# EAGLE schematic Smart_LIghts (EAGLE 9.5.1)
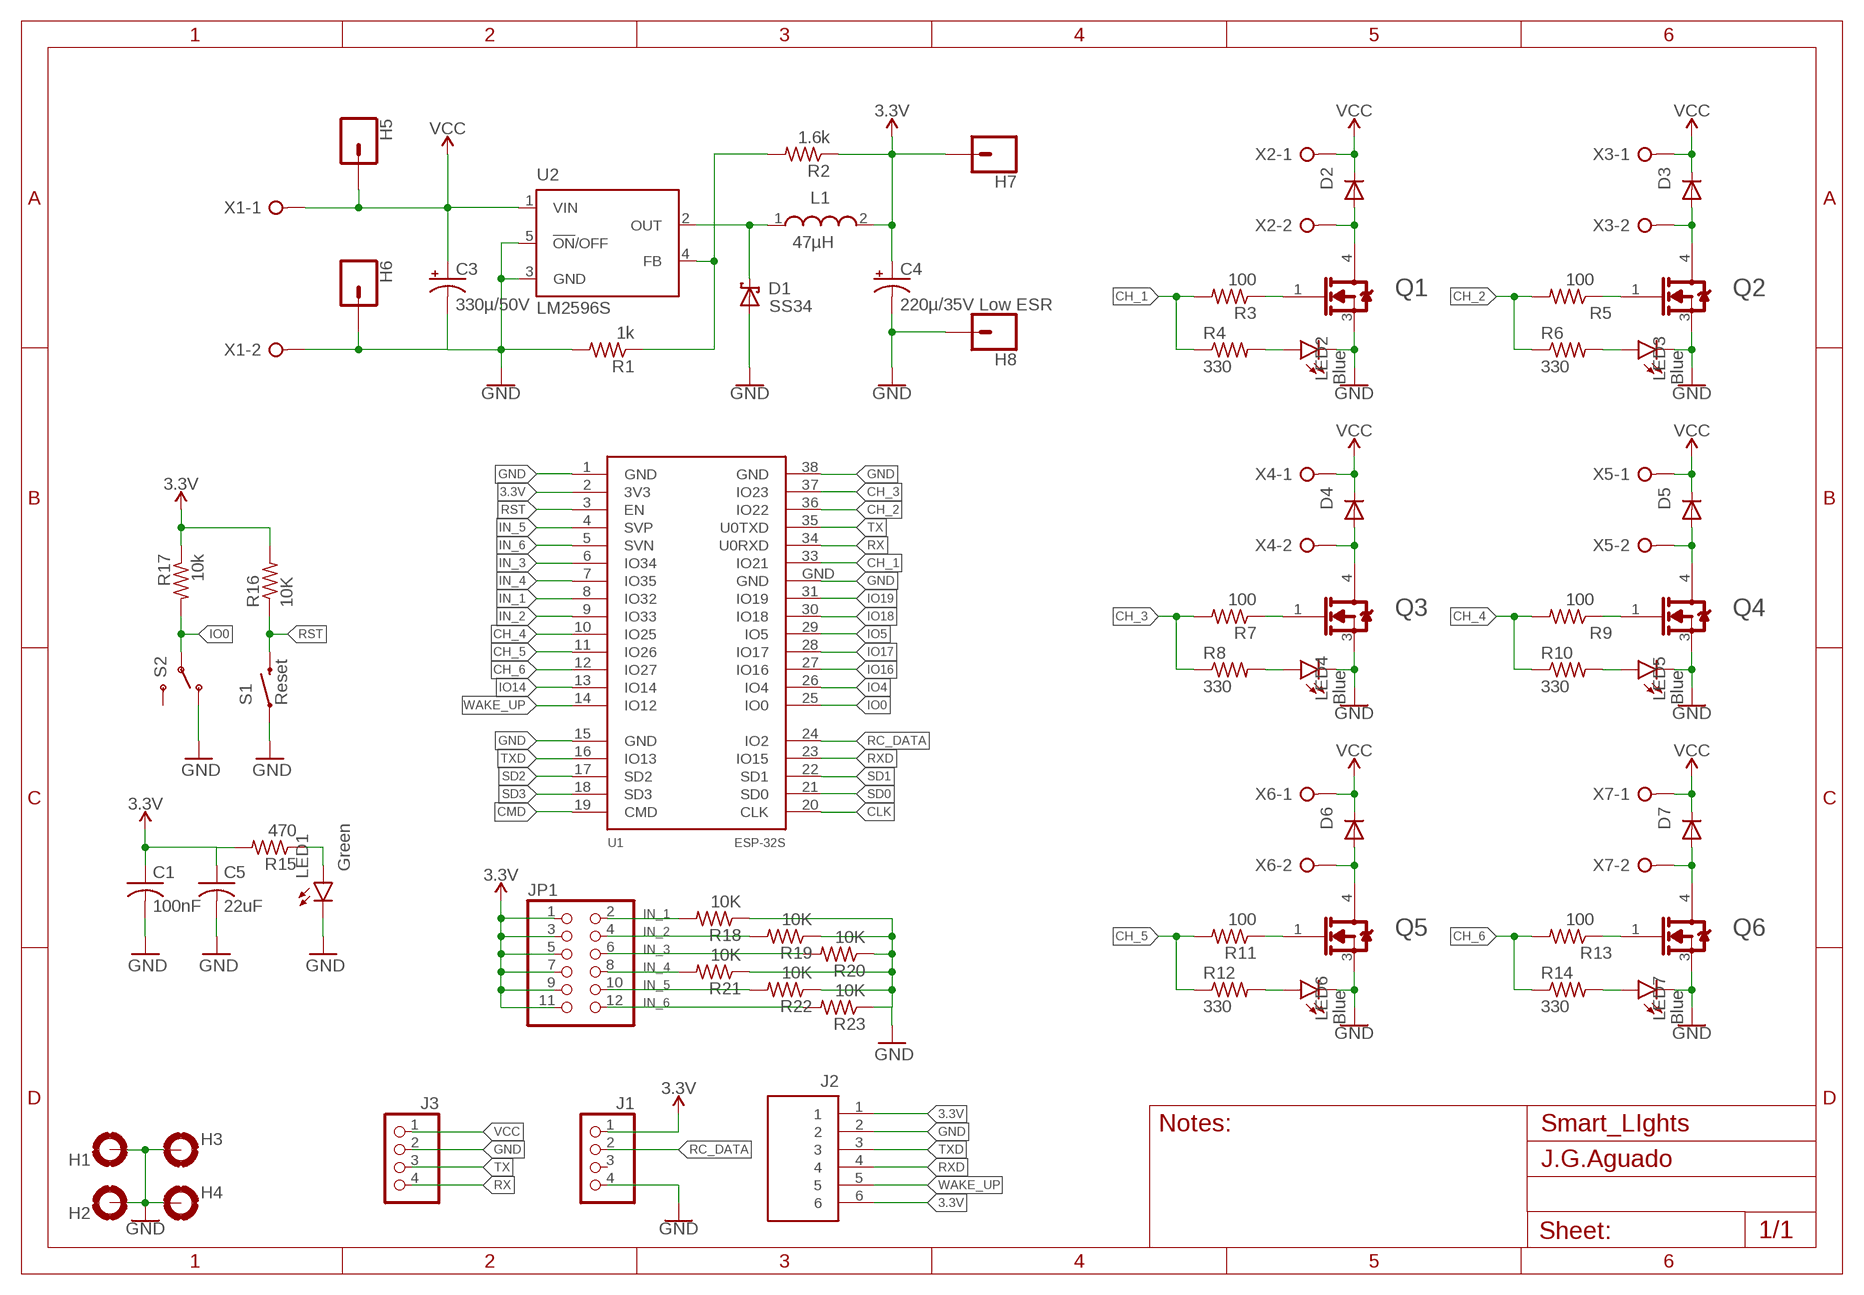
[diagram p0: schematic, sheet 1]

## Parts
C1  100nF  C-USC0603  [C0603]
C3  330µ/50V  CPOL-USF  [PANASONIC_F]
C4  220µ/35V Low ESR  CPOL-USF  [PANASONIC_F]
C5  22uF  C-USC0603  [C0603]
D1  SS34  SCHOTTKY-DIODESMD  [SMB]
D2  DIODE-SOD123  [SOD123]
D3  DIODE-SOD123  [SOD123]
D4  DIODE-SOD123  [SOD123]
D5  DIODE-SOD123  [SOD123]
D6  DIODE-SOD123  [SOD123]
D7  DIODE-SOD123  [SOD123]
H1  MOUNT-PAD-ROUND3.0  [3,0-PAD]
H2  MOUNT-PAD-ROUND3.0  [3,0-PAD]
H3  MOUNT-PAD-ROUND3.0  [3,0-PAD]
H4  MOUNT-PAD-ROUND3.0  [3,0-PAD]
H5  CONN_01PTH_2MM  [1X01_2MM]
H6  CONN_01PTH_2MM  [1X01_2MM]
H7  CONN_01PTH_2MM  [1X01_2MM]
H8  CONN_01PTH_2MM  [1X01_2MM]
J1  PINHD-1X4  [1X04]
J2  JST_6_PIN_VERTICAL  [JST-6-SMD-VERT-1.0MM]
J3  PINHD-1X4  [1X04]
JP1  PINHD-2X6  [2X06]
L1  47µH  WE-PD_1260/1245/1280/1210  [WE-PD_1260/1245/1280/1210]
LED1  Green  LEDSML0603  [SML0603]
LED2  Blue  LEDSML0603  [SML0603]
LED3  Blue  LEDSML0603  [SML0603]
LED4  Blue  LEDSML0603  [SML0603]
LED5  Blue  LEDSML0603  [SML0603]
LED6  Blue  LEDSML0603  [SML0603]
LED7  Blue  LEDSML0603  [SML0603]
Q1  IRLR2905TRPBF  INFINEON_TECHNOLOGIES_IRLR2905TRPBFINFINEON_TECHNOLOGIES_IRLR2905TRPBF_0_0  [INFINEON_TECHNOLOGIES_IRLR2905TRPBF_0]
Q2  IRLR2905TRPBF  INFINEON_TECHNOLOGIES_IRLR2905TRPBFINFINEON_TECHNOLOGIES_IRLR2905TRPBF_0_0  [INFINEON_TECHNOLOGIES_IRLR2905TRPBF_0]
Q3  IRLR2905TRPBF  INFINEON_TECHNOLOGIES_IRLR2905TRPBFINFINEON_TECHNOLOGIES_IRLR2905TRPBF_0_0  [INFINEON_TECHNOLOGIES_IRLR2905TRPBF_0]
Q4  IRLR2905TRPBF  INFINEON_TECHNOLOGIES_IRLR2905TRPBFINFINEON_TECHNOLOGIES_IRLR2905TRPBF_0_0  [INFINEON_TECHNOLOGIES_IRLR2905TRPBF_0]
Q5  IRLR2905TRPBF  INFINEON_TECHNOLOGIES_IRLR2905TRPBFINFINEON_TECHNOLOGIES_IRLR2905TRPBF_0_0  [INFINEON_TECHNOLOGIES_IRLR2905TRPBF_0]
Q6  IRLR2905TRPBF  INFINEON_TECHNOLOGIES_IRLR2905TRPBFINFINEON_TECHNOLOGIES_IRLR2905TRPBF_0_0  [INFINEON_TECHNOLOGIES_IRLR2905TRPBF_0]
R1  1k  R-US_R0603  [R0603]
R2  1.6k  R-US_R0603  [R0603]
R3  100  R-US_R0603  [R0603]
R4  330  R-US_R0603  [R0603]
R5  100  R-US_R0603  [R0603]
R6  330  R-US_R0603  [R0603]
R7  100  R-US_R0603  [R0603]
R8  330  R-US_R0603  [R0603]
R9  100  R-US_R0603  [R0603]
R10  330  R-US_R0603  [R0603]
R11  100  R-US_R0603  [R0603]
R12  330  R-US_R0603  [R0603]
R13  100  R-US_R0603  [R0603]
R14  330  R-US_R0603  [R0603]
R15  470  R-US_R0603  [R0603]
R16  10K  R-US_R0603  [R0603]
R17  10k  R-US_R0603  [R0603]
R18  10K  R-US_R0603  [R0603]
R19  10K  R-US_R0603  [R0603]
R20  10K  R-US_R0603  [R0603]
R21  10K  R-US_R0603  [R0603]
R22  10K  R-US_R0603  [R0603]
R23  10K  R-US_R0603  [R0603]
S1  Reset  SWITCH-MOMENTARY-2SMD-4  [TACTILE_SWITCH_TALL]
S2  SWITCH_SPDT  [KPS-1290]
U1  ESP-32S  [ESP-32S]
U2  LM2596S  [TO263-5]
X1  W237-02P  [W237-132]
X2  W237-02P  [W237-132]
X3  W237-02P  [W237-132]
X4  W237-02P  [W237-132]
X5  W237-02P  [W237-132]
X6  W237-02P  [W237-132]
X7  W237-02P  [W237-132]

## Nets
3.3V: C1.1 C4.+ C5.1 H7.1 J1.1 J2.1 J2.6 JP1.1 JP1.3 JP1.5 JP1.7 JP1.9 JP1.11 L1.2 R2.1 R15.2 R16.2 R17.1 U1.2(3V3)
CH_1: R3.2 R4.1 U1.33(IO21)
CH_2: R5.2 R6.1 U1.36(IO22)
CH_3: R7.2 R8.1 U1.37(IO23)
CH_4: R9.2 R10.1 U1.10(IO25)
CH_5: R11.2 R12.1 U1.11(IO26)
CH_6: R13.2 R14.1 U1.12(IO27)
CLK: U1.20(CLK)
CMD: U1.19(CMD)
GND: C1.2 C3.- C4.- C5.2 D1.A H1.B3,0(MOUNT) H2.B3,0(MOUNT) H3.B3,0(MOUNT) H4.B3,0(MOUNT) H6.1 H8.1 J1.4 J2.2 J3.2 LED1.C LED2.C LED3.C LED4.C LED5.C LED6.C LED7.C Q1.3(SOURCE) Q2.3(SOURCE) Q3.3(SOURCE) Q4.3(SOURCE) Q5.3(SOURCE) Q6.3(SOURCE) R1.2 R18.1 R19.1 R20.1 R21.1 R22.1 R23.1 S1.A2 S2.O U1.1(GND) U1.15(GND) U1.38(GND) U1.GND U2.3(GND) U2.5(!ON!/OFF) X1.2
IN_1: JP1.2 R18.2 U1.8(IO32)
IN_2: JP1.4 R19.2 U1.9(IO33)
IN_3: JP1.6 R20.2 U1.6(IO34)
IN_4: JP1.8 R21.2 U1.7(IO35)
IN_5: JP1.10 R22.2 U1.4(SVP)
IN_6: JP1.12 R23.2 U1.5(SVN)
IO0: R17.2 S2.P U1.25(IO0)
IO4: U1.26(IO4)
IO5: U1.29(IO5)
IO14: U1.13(IO14)
IO16: U1.27(IO16)
IO17: U1.28(IO17)
IO18: U1.30(IO18)
IO19: U1.31(IO19)
N$1: Q2.1(GATE) R5.1
N$2: D1.C L1.1 U2.2(OUT)
N$3: R1.1 R2.2 U2.4(FB)
N$4: D2.A Q1.4(DRAIN) X2.2
N$5: Q1.1(GATE) R3.1
N$6: D3.A Q2.4(DRAIN) X3.2
N$7: Q3.1(GATE) R7.1
N$8: D4.A Q3.4(DRAIN) X4.2
N$9: Q4.1(GATE) R9.1
N$10: D5.A Q4.4(DRAIN) X5.2
N$11: Q5.1(GATE) R11.1
N$12: D6.A Q5.4(DRAIN) X6.2
N$13: Q6.1(GATE) R13.1
N$14: D7.A Q6.4(DRAIN) X7.2
N$15: LED1.A R15.1
N$16: LED4.A R8.2
N$17: LED2.A R4.2
N$18: LED3.A R6.2
N$19: LED5.A R10.2
N$20: LED6.A R12.2
N$21: LED7.A R14.2
RC_DATA: J1.2 U1.24(IO2)
RST: R16.1 S1.B2 U1.3(EN)
RX: J3.4 U1.34(U0RXD)
RXD: J2.4 U1.23(IO15)
SD0: U1.21(SD0)
SD1: U1.22(SD1)
SD2: U1.17(SD2)
SD3: U1.18(SD3)
TX: J3.3 U1.35(U0TXD)
TXD: J2.3 U1.16(IO13)
VCC: C3.+ D2.C D3.C D4.C D5.C D6.C D7.C H5.1 J3.1 U2.1(VIN) X1.1 X2.1 X3.1 X4.1 X5.1 X6.1 X7.1
WAKE_UP: J2.5 U1.14(IO12)
Unconnected: J1.3 S2.S

## Notes on the sheet
- Notes:
- J.G.Aguado

## Library data of the parts
C1 C5 = rcl:C-US: CAPACITOR, American symbol; SPICEPREFIX: C
C3 = rcl:CPOL-US: POLARIZED CAPACITOR, American symbol; MF: Panasonic; MFN: EEVFK1H221P; SPICEPREFIX: C
C4 = rcl:CPOL-US: POLARIZED CAPACITOR, American symbol; MF: Panasonic; MFN: EINTRAGEN!; SPICEPREFIX: C
D1 = diode:SCHOTTKY-DIODE: Schottky Diode
D2-D7 = diode:DIODE-: DIODE
H1-H4 = holes:MOUNT-PAD-ROUND: MOUNTING PAD, round
H5-H8 = SparkFun-Connectors:CONN_01: Single connection point. Often used as Generic Header-pin footprint for 0.1 inch spaced/style header connections On any of the 0.1 inch spaced packages, you can populate with these: Break Away Headers - Straight <https://www.sparkfun.com/products/116> (PRT-00116) Break Away Male Headers - Right Angle <https://www.sparkfun.com/products/553> (PRT-00553) Female Headers <https://www.sparkfun.com/products/115> (PRT-00115) Break Away Headers - Machine Pin <https://www.sparkfun.com/products/117> (PRT-00117) Break Away Female Headers - Swiss Machine Pin <https://www.sparkfun.com/products/743> (PRT-00743) This device is also useful as a general connection point to wire up your design to another part of your project. Our various solder wires solder well into these plated through hole pads. Hook-Up Wire - Assortment (Stranded, 22 AWG) <https://www.sparkfun.com/products/11375> (PRT-11375) Hook-Up Wire - Assortment (Solid Core, 22 AWG) <https://www.sparkfun.com/products/11367> (PRT-11367) View the entire wire category on our website here <https://www.sparkfun.com/categories/141> Special notes: SMTSO-256-ET is a "flush mount" nut for a 4-40 screw. We mostly use this on specialty testbeds; it is a nice way to connect hardware to your PCB at an adjustable hieght. Also note, the SNAP packages are for using a snappable style connector. We sell a baggie of snaps and they are also used on two LilyPad designs: Snap Assortment - 30 pack (male and female) <https://www.sparkfun.com/products/11347> (DEV-11347) LilyPad Arduino SimpleSnap <https://www.sparkfun.com/products/10941> (DEV-10941) LilyPad SimpleSnap Protoboard <https://www.sparkfun.com/products/10940> (DEV-10940)
J1 J3 = pinhead:PINHD-1X4: PIN HEADER
J2 = SparkFun-Connectors:JST_6_PIN_VERTICAL: JST 6 pin vertical connector Here is a six pin vertical 1.0mm pitch connector. It is useful if you need something very tiny as a connection. These are not the standard JST type connectors we use on most of our boards, but are actually the much smaller JST-SH type. Here is the connector we sell at SparkFun: JST SH Vertical 6-Pin Connector - SMD <https://www.sparkfun.com/products/579> (GPS-00579) Datasheet <http://www.sparkfun.com/datasheets/GPS/EM406-SMDConnector-eSH.pdf> It was used on these SparkFun products: SparkFun GPS Breakout <https://www.sparkfun.com/products/11818> (BOB-11818) SparkFun Weather Shield <https://www.sparkfun.com/products/12081> (DEV-12081) And many, many other GPS related products.; PROD_ID: CONN-08249; SF_ID: GPS-00579
JP1 = pinhead:PINHD-2X6: PIN HEADER
L1 = Wurth_Elektronik_Passive_rev15b:WE-PD: SMD Shielded Power Inductor Characteristics Magnetically shielded version which results in a low leakage field High Saturation currents up to 25 A Very low self-losses at high switching frequency‘s Wide inductances spectrum available at all sizes Operating temperature: –40 °C to +125 °C Applications Perfectly suitable for switching regulators with extremely high efficiency Integrated DC/DC- converter Switching regulators with low operating voltages (Graphic cards, embedded PC-Cards, Mainboards) Plastic base: Because of the one piece construction these are more suitable for high vibration or shock applications <http://katalog.we-online.de/media/images/eisos/FePBF_pf2.jpg> Details see: http://katalog.we-online.de/en/pbs/WE-PD? Updated by Dan Xu 2014-07-08 2014 (C) Wurth Elektronik; MF: Wuerth
LED1-LED7 = led:LED: LED OSRAM: - CHIPLED LG R971, LG N971, LY N971, LG Q971, LY Q971, LO R971, LY R971 LH N974, LH R974 LS Q976, LO Q976, LY Q976 LO Q996 - Hyper CHIPLED LW Q18S LB Q993, LB Q99A, LB R99A - SideLED LS A670, LO A670, LY A670, LG A670, LP A670 LB A673, LV A673, LT A673, LW A673 LH A674 LY A675 LS A676, LA A676, LO A676, LY A676, LW A676 LS A679, LY A679, LG A679 - Hyper Micro SIDELED® LS Y876, LA Y876, LO Y876, LY Y876 LT Y87S - SmartLED LW L88C, LW L88S LB L89C, LB L89S, LG L890 LS L89K, LO L89K, LY L89K LS L896, LA L896, LO L896, LY L896 - TOPLED LS T670, LO T670, LY T670, LG T670, LP T670 LSG T670, LSP T670, LSY T670, LOP T670, LYG T670 LG T671, LOG T671, LSG T671 LB T673, LV T673, LT T673, LW T673 LH T674 LS T676, LA T676, LO T676, LY T676, LB T676, LH T676, LSB T676, LW T676 LB T67C, LV T67C, LT T67C, LS T67K, LO T67K, LY T67K, LW E67C LS E67B, LA E67B, LO E67B, LY E67B, LB E67C, LV E67C, LT E67C LW T67C LS T679, LY T679, LG T679 LS T770, LO T770, LY T770, LG T770, LP T770 LB T773, LV T773, LT T773, LW T773 LH T774 LS E675, LA E675, LY E675, LS T675 LS T776, LA T776, LO T776, LY T776, LB T776 LHGB T686 LT T68C, LB T68C - Hyper Mini TOPLED® LB M676 - Mini TOPLED Santana® LG M470 LS M47K, LO M47K, LY M47K Source: http://www.osram.convergy.de LUXEON: - LUMILED® LXK2-PW12-R00, LXK2-PW12-S00, LXK2-PW14-U00, LXK2-PW14-V00 LXK2-PM12-R00, LXK2-PM12-S00, LXK2-PM14-U00 LXK2-PE12-Q00, LXK2-PE12-R00, LXK2-PE12-S00, LXK2-PE14-T00, LXK2-PE14-U00 LXK2-PB12-K00, LXK2-PB12-L00, LXK2-PB12-M00, LXK2-PB14-N00, LXK2-PB14-P00, LXK2-PB14-Q00 LXK2-PR12-L00, LXK2-PR12-M00, LXK2-PR14-Q00, LXK2-PR14-R00 LXK2-PD12-Q00, LXK2-PD12-R00, LXK2-PD12-S00 LXK2-PH12-R00, LXK2-PH12-S00 LXK2-PL12-P00, LXK2-PL12-Q00, LXK2-PL12-R00 Source: www.luxeon.com KINGBRIGHT: KA-3528ASYC Source: www.kingbright.com
Q1-Q6 = Infineon Technologies - IRLR2905TRPBF:INFINEON_TECHNOLOGIES_IRLR2905TRPBF: MOSFET N-CH 55V 42A DPAK; AUTOMOTIVE: No; CENTROID_NOT_SPECIFIED: Yes; CONTINUOUS_DRAIN_CURRENT: 42A; DATASHEET: https://www.infineon.com/dgdl/irlr2905pbf.pdf?fileId=5546d462533600a40153566cc2bb2679; DEPLETION_MODE: False; DEVICE_CLASS_L1: Discrete Semiconductors; DEVICE_CLASS_L2: Transistors; DEVICE_CLASS_L3: MOSFETs; DIGIKEY_DESCRIPTION: TRANS MOSFET N-CH 55V 42A DPAK; DIGIKEY_PART_NUMBER: IRLR2905PBFCT-ND; DRAIN_TO_SOURCE_BREAKDOWN_VOLTAGE: 55V; DRAIN_TO_SOURCE_RESISTANCE: 0.03Ω; DRAIN_TO_SOURCE_VOLTAGE: 55V; FOOTPRINT_URL: http://www.irf.com/package/hexfet/dpakfootprint.pdf; FOOTPRINT_VARIANT_NAME_0: Recommended_Land_Pattern; GATE_CHARGE_AT_VGS: 48nC @ 5V; GATE_TO_SOURCE_VOLTAGE: 16V; HEIGHT: 2.52mm; INPUT_CAPACITACE_AT_VDS: 1700pF @ 25V; LEAD_FREE: Yes; MAX_FORWARD_DIODE_VOLTAGE: 1.3V; MAX_JUNCTION_TEMP: +175°C; MF: Infineon Technologies; MFG_PACKAGE_IDENT: PG-TO252-3; MFG_PACKAGE_IDENT_DATE: 0; MFG_PACKAGE_IDENT_REV: 901; MOUSER_PART_NUMBER: 942-IRLR2905TRPBF; MPN: IRLR2905TRPBF; NUMBER_OF_CHANNELS: 1; NUMBER_OF_N_CHANNELS: 1; PACKAGE: D-Pak; POWER_DISSIPATION: 110W; PREFIX: Q; PULSE_DRAIN_CURRENT: 160A; REVERSE_RECOVERY_CHARGE: 210nC; REVERSE_RECOVERY_TIME: 80ns; ROHS: Yes; RTHJA_MAX: 110°C/W; TEMPERATURE_RANGE_HIGH: +175°C; TEMPERATURE_RANGE_LOW: -55°C; THRESHOLD_VGS_MAX: 2V; THRESHOLD_VGS_MIN: 1V; TURN_OFF_DELAY_TIME: 26ns; TURN_ON_DELAY_TIME: 11ns; VERIFICATION_VERSION: 0.0.0.3
R1-R23 = rcl:R-US_: RESISTOR, American symbol; SPICEPREFIX: R
S1 = Testing:SWITCH-MOMENTARY-2: Various NO switches- pushbuttons, reed, etc
S2 = SparkFun-Retired:SWITCH_SPDT: SWCH-10651 Side-actuated SPDT slide switch, as used on the Arduino Pro; PROD_ID: SWCH-10651
U1 = esp32:ESP-32S: Ai-Thinker ESP-32S
U2 = national-semiconductor:LM2596: SIMPLE SWITCHER® Power Converter 150 kHz 3A Step-Down Voltage Regulator Source: http://www.national.com/ds/LM/LM2596.pdf; MF: NATIONAL SEMICONDUCTOR; MPN: LM2596S-ADJ/NOPB; OC_FARNELL: 9494367; OC_NEWARK: 41K3842
X1-X7 = con-wago-508:W237-02P: WAGO SREW CLAMP; OC_FARNELL: unknown; OC_NEWARK: unknown

## Net classes
0 default: clearance 0.205 mm
2 analog: width 0.203 mm, drill 0.33 mm, clearance 0.152 mm